# EAGLE design nRF52832_MCU (EAGLE 9.6.2)
Contributed by Nordic Semiconductor Product Page here <http://infocenter.nordicsemi.com/index.jsp?topic=%2Fcom.nordic.infocenter.nrf52832.ps.v1.1%2Fref_circuitry.html> Disclaimer: For the most up to date reference layout see the infocenter at nordicsemi.com Description: Bluetooth Low Energy board

## Sheet 1 of 2
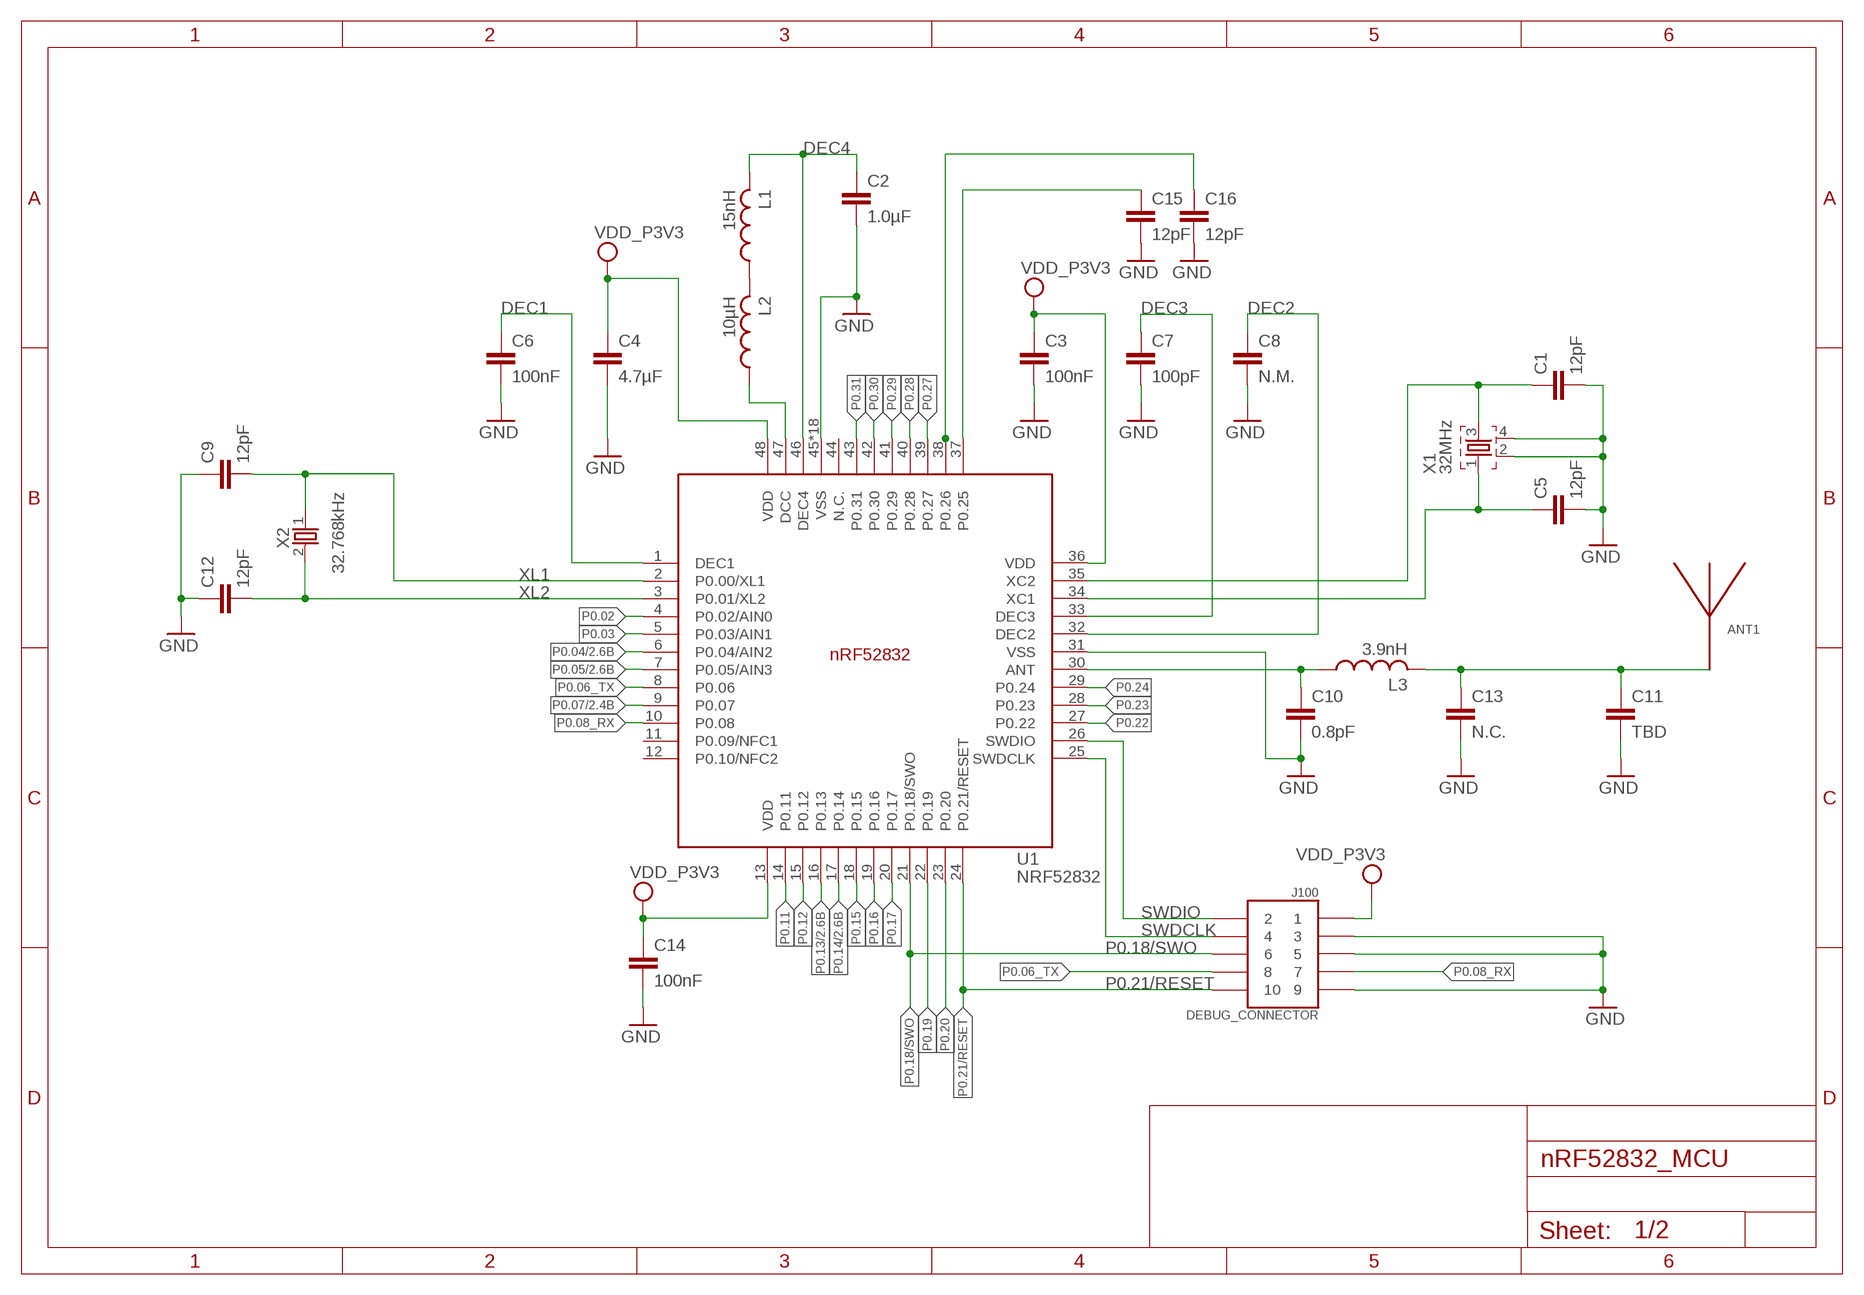
[diagram p0: schematic, sheet 1]

### Parts
ANT1  ANTENNA_QUARTER-WAVE_MONOPOLE_MEANDERED_LEFT  [QWMP_MEANDERED_LEFT_+6]
C1  12pF  CAPACITOR_0402_N  [RESC0402_N]
C2  1.0µF  CAPACITOR_0603_N  [RESC0603_N]
C3  100nF  CAPACITOR_0402_N  [RESC0402_N]
C4  4.7µF  CAPACITOR_0603_N  [RESC0603_N]
C5  12pF  CAPACITOR_0402_N  [RESC0402_N]
C6  100nF  CAPACITOR_0402_N  [RESC0402_N]
C7  100pF  CAPACITOR_0402_N  [RESC0402_N]
C8  N.M.  CAPACITOR_0402_N  [RESC0402_N]
C9  12pF  CAPACITOR_0402_N  [RESC0402_N]
C10  0.8pF  CAPACITOR_0402_N  [RESC0402_N]
C11  TBD  CAPACITOR_0402_N  [RESC0402_N]
C12  12pF  CAPACITOR_0402_N  [RESC0402_N]
C13  N.C.  CAPACITOR_0402_N  [RESC0402_N]
C14  100nF  CAPACITOR_0402_N  [RESC0402_N]
C15  12pF  CAPACITOR_0402_N  [RESC0402_N]
C16  12pF  CAPACITOR_0402_N  [RESC0402_N]
J100  DEBUG_CONNECTOR  [HDRV127P5X2-10_N]
L1  15nH  INDUCTOR_0402_N  [RESC0402_N]
L2  10µH  INDUCTOR_0603_N  [RESC0603_N]
L3  3.9nH  INDUCTOR_0402_N  [RESC0402_N]
U1  NRF52832  [QFN40P600X600X90-48_N]
X1  32MHz  XTAL_32MHZ  [BT-XTAL_2016_N]
X2  32.768kHz  XTAL_32KHZ  [XTAL_3215_N]

### Nets
ANT: C10.1 L3.1 U1.30(ANT)
DEC1: C6.1 U1.1(DEC1)
DEC2: C8.1 U1.32(DEC2)
DEC3: C7.1 U1.33(DEC3)
DEC4: C2.1 L1.2 U1.46(DEC4)
N$2: L1.1 L2.2
N$3: C1.1 U1.35(XC2) X1.3
N$4: L2.1 U1.47(DCC)
N$5: ANT1.P$1 C11.1 C13.1 L3.2
N$10: C1.2 C2.2 C3.2 C4.2 C5.2 C6.2 C7.2 C8.2 C9.1 C10.2 C11.2 C12.1 C13.2 C14.2 C15.2 C16.2 J100.3 J100.5 J100.9 U1.31(VSS) U1.45(VSS) U1.PAD(VSS) U1.PAD@VIA01(VSS) U1.PAD@VIA02(VSS) U1.PAD@VIA03(VSS) U1.PAD@VIA04(VSS) U1.PAD@VIA05(VSS) U1.PAD@VIA06(VSS) U1.PAD@VIA07(VSS) U1.PAD@VIA08(VSS) U1.PAD@VIA09(VSS) U1.PAD@VIA10(VSS) U1.PAD@VIA11(VSS) U1.PAD@VIA12(VSS) U1.PAD@VIA13(VSS) U1.PAD@VIA14(VSS) U1.PAD@VIA15(VSS) U1.PAD@VIA16(VSS) X1.2 X1.4 ; supply symbol labelled GND ; also sheet 2
P0.02: U1.4(P0.02/AIN0)
P0.03: U1.5(P0.03/AIN1)
P0.04: U1.6(P0.04/AIN2) ; also sheet 2
P0.05: U1.7(P0.05/AIN3) ; also sheet 2
P0.06_TX: J100.8 U1.8(P0.06)
P0.07: U1.9(P0.07) ; also sheet 2
P0.08_RX: J100.7 U1.10(P0.08)
P0.11: U1.14(P0.11)
P0.12: U1.15(P0.12)
P0.13: U1.16(P0.13) ; also sheet 2
P0.14: U1.17(P0.14) ; also sheet 2
P0.15: U1.18(P0.15)
P0.16: U1.19(P0.16)
P0.17: U1.20(P0.17)
P0.18/SWO: J100.6 U1.21(P0.18/SWO)
P0.19: U1.22(P0.19)
P0.20: U1.23(P0.20)
P0.21/RESET: J100.10 U1.24(P0.21/RESET)
P0.22: U1.27(P0.22)
P0.23: U1.28(P0.23)
P0.24: U1.29(P0.24)
P0.25: C15.1 U1.37(P0.25)
P0.26: C16.1 U1.38(P0.26)
P0.27: U1.39(P0.27)
P0.28: U1.40(P0.28)
P0.29: U1.41(P0.29)
P0.30: U1.42(P0.30)
P0.31: U1.43(P0.31)
SWDCLK: J100.4 U1.25(SWDCLK)
SWDIO: J100.2 U1.26(SWDIO)
VDD_P3V3: C3.1 C4.1 C14.1 J100.1 U1.13(VDD) U1.36(VDD) U1.48(VDD) ; also sheet 2
X1: C5.1 U1.34(XC1) X1.1
XL1: C9.2 U1.2(P0.00/XL1) X2.1
XL2: C12.2 U1.3(P0.01/XL2) X2.2
Unconnected: U1.11(P0.09/NFC1) U1.12(P0.10/NFC2) U1.44(N.C.)

## Sheet 2 of 2
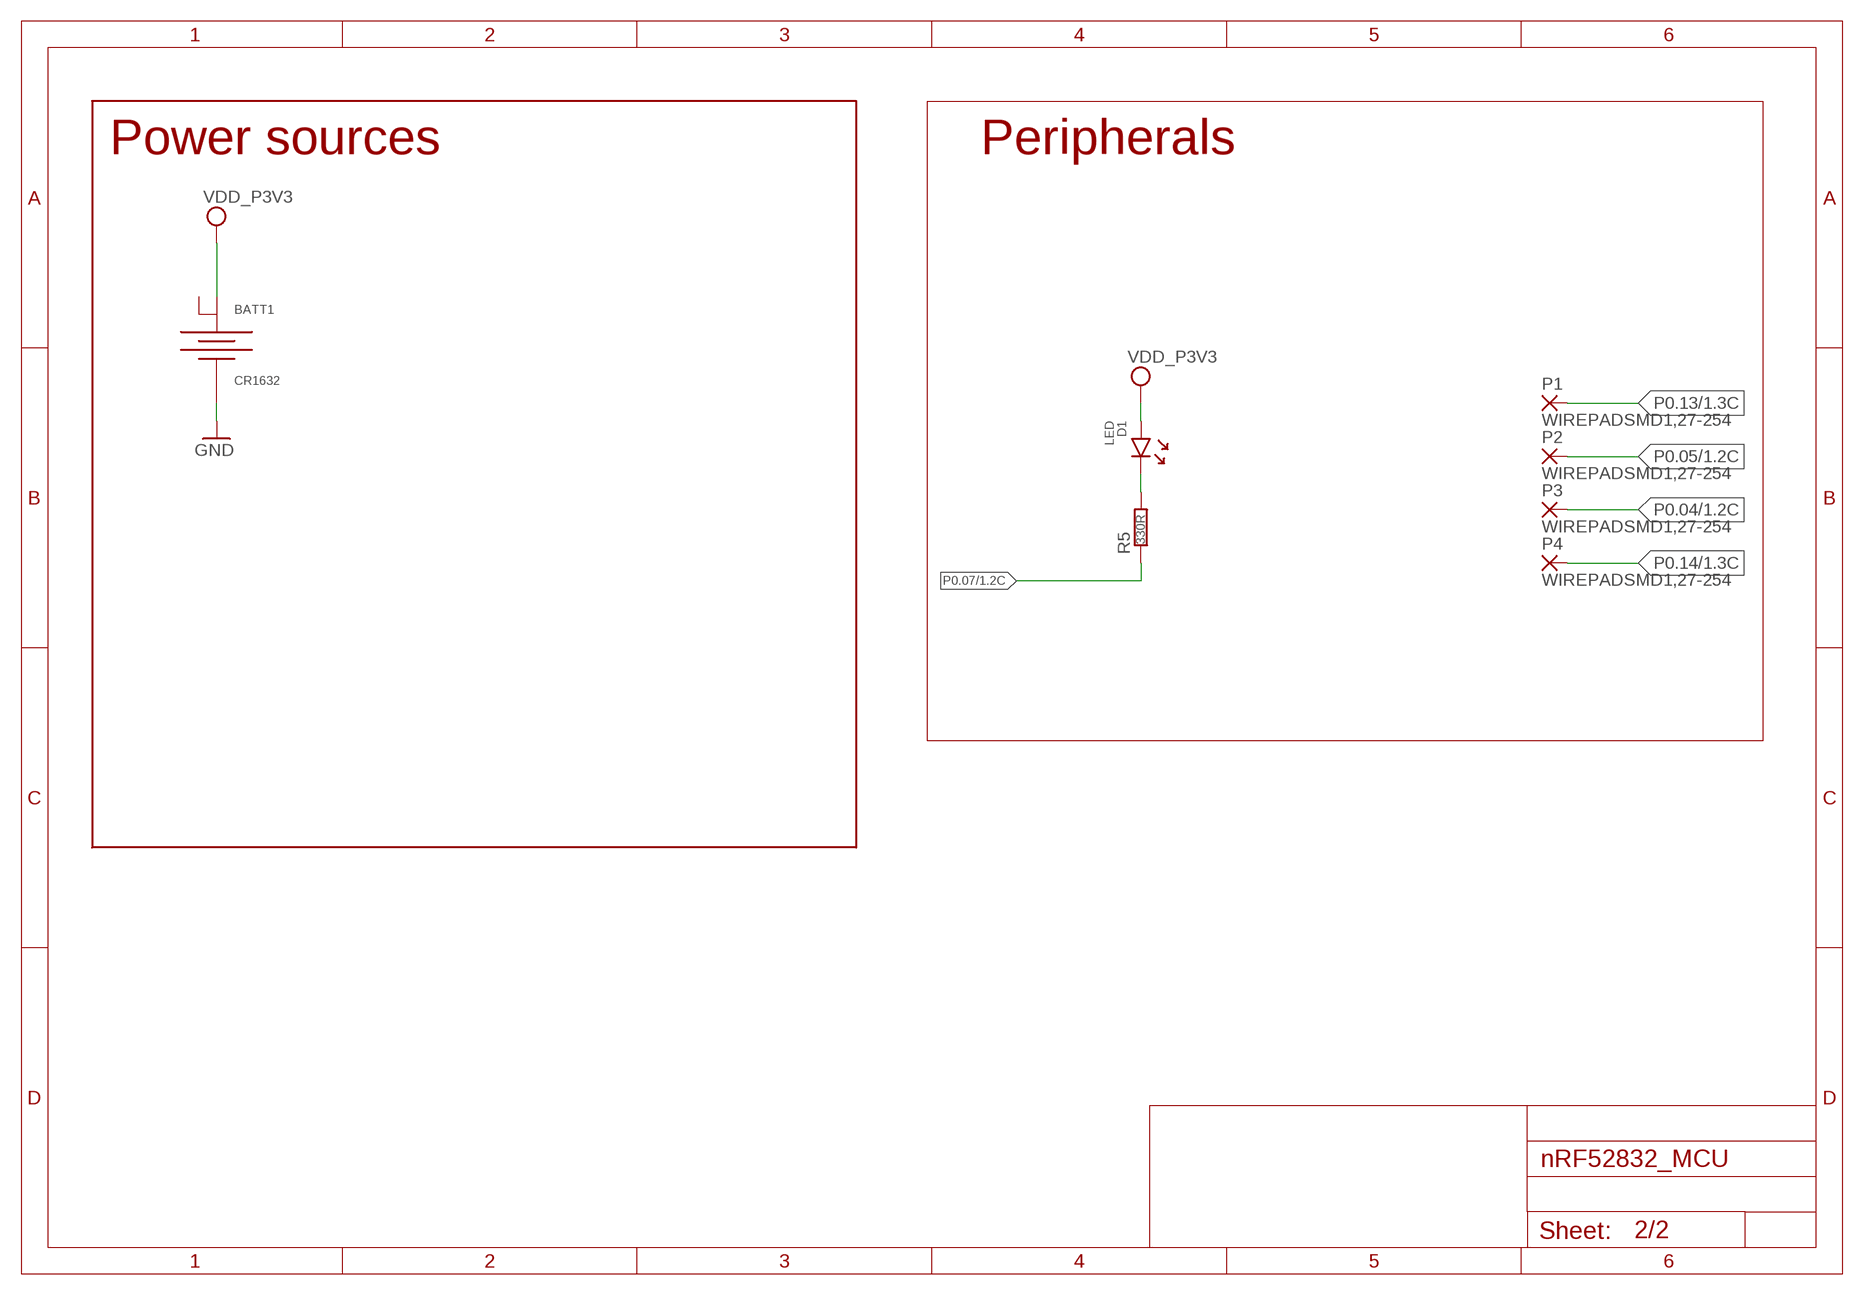
[diagram p1: schematic, sheet 2]

### Parts
BATT1  CR1632  [CR1632_HOLDER_TH]
D1  LED  [DIOC0603_N]
P1  WIREPADSMD1,27-254  [SMD1,27-2,54]
P2  WIREPADSMD1,27-254  [SMD1,27-2,54]
P3  WIREPADSMD1,27-254  [SMD1,27-2,54]
P4  WIREPADSMD1,27-254  [SMD1,27-2,54]
R5  330R  RESISTOR_0402_N  [RESC0402_N]

### Nets
N$8: D1.1(C) R5.2
N$10: BATT1.1(-) ; supply symbol labelled GND ; also sheet 1
P0.04: P3.1(P) ; also sheet 1
P0.05: P2.1(P) ; also sheet 1
P0.07: R5.1 ; also sheet 1
P0.13: P1.1(P) ; also sheet 1
P0.14: P4.1(P) ; also sheet 1
VDD_P3V3: BATT1.2(+) D1.2(A) ; also sheet 1
Unconnected: BATT1.3(+2)

### Notes on the sheet
- Power sources | Peripherals

## Library data of the parts
ANT1 = Nordic_misc:ANTENNA_QUARTER-WAVE_MONOPOLE_MEANDERED_LEFT
BATT1 = Nordic_misc:CR1632: KEYSTONE 3013 BATTERY THM RETAINER, 16MM Farnell: 1650698
C1-C16 = Nordic_misc:CAPACITOR: Generic chip capacitor
D1 = Nordic_misc:LED
J100 = Nordic_misc:DEBUG_CONNECTOR
L1-L3 = Nordic_misc:INDUCTOR: Generic chip inductor
P1-P4 = wirepad:WIREPAD: Wire PAD connect wire on PCB
R5 = Nordic_misc:RESISTOR: Generic chip resistor
U1 = Nordic_nRF:NRF52832: nRF52832 Features Single chip, highly flexible, 2.4 GHz multi-protocol SoC 32-bit ARM Cortex-M4F Processor 1.7v to 3.6v operation 512kB flash + 64kB RAM Supports concurrent Bluetooth Smart/ANT protocol operation On-chip NFC tag for Out-of-Band (OOB) pairing Up to +4dBm output power -96dBm sensitivity, Bluetooth Smart Thread safe and run-time protected Event driven API On air compatible with nRF24L and nRF24AP series 2 data rates (2Mbps/1Mbps) PPI - maximum flexibility for power-efficient applications and code simplification Automated power management system with automatic power management of each peripheral Configurable I/O mapping for analog and digital I/O 3 x Master/Slave SPI 2 x Two-wire interface (I²C) UART (RTS/CTS) 3 x PWM AES HW encryption Real Time Counter (RTC) Digital microphone interface (PDM) On-chip balun Applications Internet of Things (IoT) Wearables SmartHome sensors Connected white goods Computer peripherals Voice-command smart remotes A4WP ‘Rezence’ wireless charging Beacons Sports and fitness sensors and hubs Connected health products Smart watches RC Toys Interactive games Building automation and sensor networks
X1 = Nordic_nRF:XTAL_32MHZ
X2 = Nordic_nRF:XTAL_32KHZ

## Net classes
0 default: clearance 0.205 mm

## Board
Contributed by Nordic Semiconductor Product Page here <http://infocenter.nordicsemi.com/index.jsp?topic=%2Fcom.nordic.infocenter.nrf52832.ps.v1.1%2Fref_circuitry.html> Disclaimer: For the most up to date reference layout see the infocenter at nordicsemi.com Description: Bluetooth Low Energy board
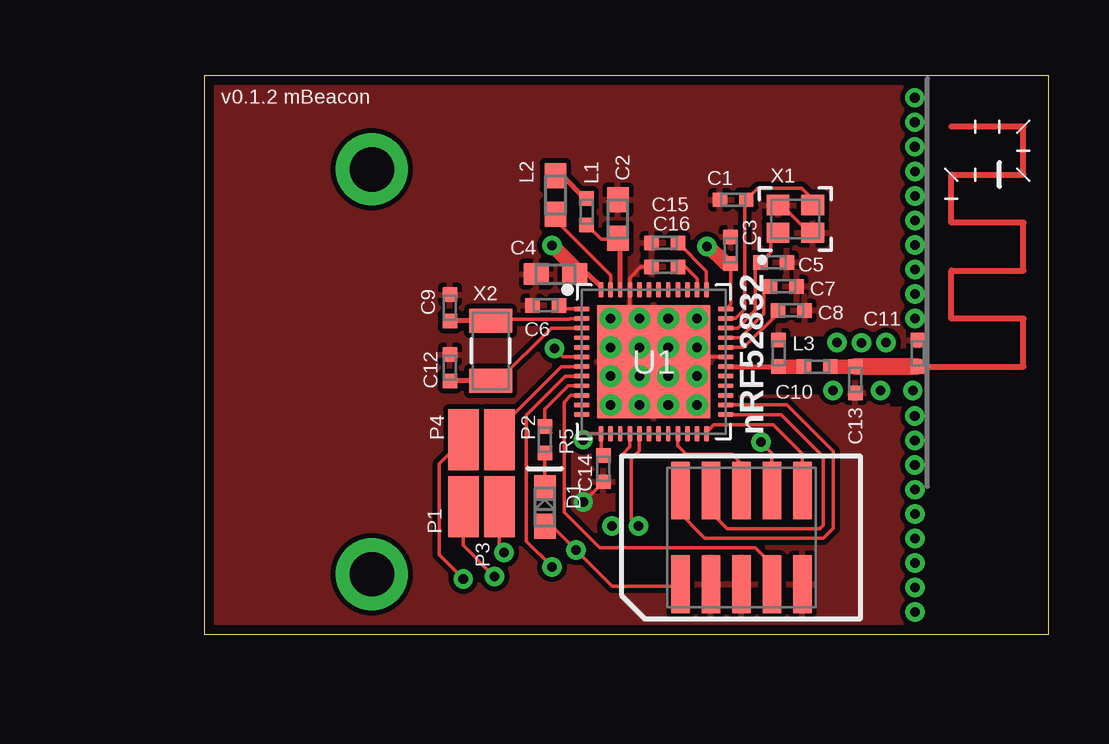
[diagram p2: board, top side]
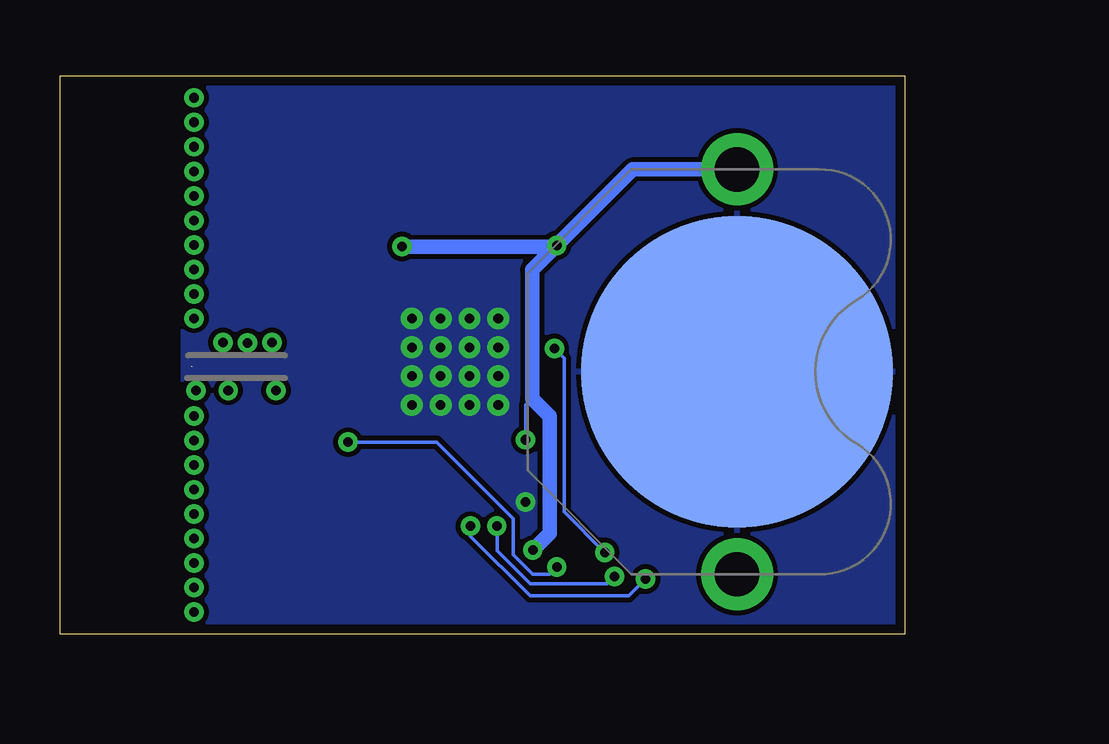
[diagram p3: board, bottom side, seen from below]

Size 35.2 x 23.26 mm. Coordinates in mm from the lower left corner, seen from the top.
Outline: 0,0 35.2,0 35.2,23.26 0,23.26 0,0
Copper layers (1*16): Top 0.035mm / dielectric 1.5mm / Bottom 0.035mm
Design rules "nRF52832_MCU *": minimum track width 0.15mm, minimum drill 0.4mm, track to track 0.15mm, track to pad 0.15mm, pad to pad 0.15mm, via to via 0.15mm, smd to smd 0.15mm, copper to edge 0.4mm, drill to drill 0.4mm, minimum pad ring 10mil, minimum via ring 8mil, stop-mask expansion 0.1mm, vias tented up to drill 0.41mm, thermal gap 0.2mm
tRestrict: area 28.6,9.5 to 30.1,11.9; area 30.2,0 to 35.2,23.1; area 22,10 to 25.7,12.4
bRestrict: area 30.2,0 to 35.2,23.1

### Footprints (pad centres in the part's own frame; a part is rotated, then mirrored left to right if it is on the bottom)
QWMP_MEANDERED_LEFT_+6 = smd 0.254 x 0.254: P$1 0,0
CR1632_HOLDER_TH = smd 13 x 13: 1 0,0 | drill 1.85 pad 3: 2 -8.435,0; 3 8.435,0
RESC0402_N = smd 0.6 x 0.6: 1 -0.55,0; 2 0.55,0
RESC0603_N = smd 1.05 x 0.9: 1 -0.8,0; 2 0.8,0
DIOC0603_N = smd 1.05 x 0.9: 1 -0.8,0; 2 0.8,0
HDRV127P5X2-10_N = smd 0.76 x 2.4: 1 -2.54,-1.95; 2 -2.54,1.95; 3 -1.27,-1.95; 4 -1.27,1.95; 5 0,-1.95; 6 0,1.95; 7 1.27,-1.95; 8 1.27,1.95; 9 2.54,-1.95; 10 2.54,1.95
SMD1,27-2,54 = smd 1.27 x 2.54: 1 0,0
QFN40P600X600X90-48_N = smd 0.65 x 0.2: 1 -3,2.2; 2 -3,1.8; 3 -3,1.4; 4 -3,1; 5 -3,0.6; 6 -3,0.2; 7 -3,-0.2; 8 -3,-0.6; 9 -3,-1; 10 -3,-1.4; 11 -3,-1.8; 12 -3,-2.2; 25 3,-2.2; 26 3,-1.8; 27 3,-1.4; 28 3,-1; 29 3,-0.6; 30 3,-0.2; 31 3,0.2; 32 3,0.6; 33 3,1; 34 3,1.4; 35 3,1.8; 36 3,2.2 | smd 0.2 x 0.65: 13 -2.2,-3; 14 -1.8,-3; 15 -1.4,-3; 16 -1,-3; 17 -0.6,-3; 18 -0.2,-3; 19 0.2,-3; 20 0.6,-3; 21 1,-3; 22 1.4,-3; 23 1.8,-3; 24 2.2,-3; 37 2.2,3; 38 1.8,3; 39 1.4,3; 40 1,3; 41 0.6,3; 42 0.2,3; 43 -0.2,3; 44 -0.6,3; 45 -1,3; 46 -1.4,3; 47 -1.8,3; 48 -2.2,3 | smd 4.7 x 4.7: PAD 0,0 | drill 0.4: PAD@VIA01 -1.8,1.8; PAD@VIA02 -1.8,0.6; PAD@VIA03 -1.8,-0.6; PAD@VIA04 -1.8,-1.8; PAD@VIA05 -0.6,1.8; PAD@VIA06 -0.6,0.6; PAD@VIA07 -0.6,-0.6; PAD@VIA08 -0.6,-1.8; PAD@VIA09 0.6,1.8; PAD@VIA10 0.6,0.6; PAD@VIA11 0.6,-0.6; PAD@VIA12 0.6,-1.8; PAD@VIA13 1.8,1.8; PAD@VIA14 1.8,0.6; PAD@VIA15 1.8,-0.6; PAD@VIA16 1.8,-1.8
BT-XTAL_2016_N = smd 0.95 x 0.85: 1 -0.725,-0.575; 2 0.725,-0.575; 3 0.725,0.575; 4 -0.725,0.575
XTAL_3215_N = smd 1 x 1.8: 1 -1.25,0; 2 1.25,0

### Placement (x,y rotation side)
ANT1  30.14,11.15 0 top
BATT1  6.99,10.93 270 bottom
C1  22.04,18.1 180 top
C2  17.24,17.3 90 top
C3  21.94,16 90 top
C4  14.64,15 180 top
C5  23.73,15.49 0 top
C6  14.24,13.7 180 top
C7  24.14,14.49 0 top
C8  24.47,13.49 0 top
C9  10.24,13.6 270 top
C10  23.94,11.7 90 top
C11  29.74,11.7 90 top
C12  10.24,11.1 270 top
C13  27.14,10.6 270 top
C14  16.64,6.9 270 top
C15  19.2,16.3 180 top
C16  19.2,15.3 180 top
D1  14.2,5.3 270 top
J100  22.39,4.03 0 top
L1  15.94,17.6 270 top
L2  14.64,18.3 90 top
L3  25.54,11.15 0 top
P1  10.8,5.3 0 top
P2  12.3,8.1 0 top
P3  12.3,5.3 0 top
P4  10.8,8.1 0 top
R5  14.2,8.1 270 top
U1  18.74,11.35 0 top
X1  24.64,17.3 0 top
X2  11.94,11.8 270 top

### Tracks (layer width: path | path; a pad name or v marks a point on that pad's centre or on a via)
ANT
  Top 0.152: C10.1 23.99,11.15
  Top 0.2: U1.30 C10.1
  Top 0.6: 23.99,11.15 L3.1
DEC1
  Top 0.152: U1.1 14.95,13.55 14.86,13.58 14.74,13.7 C6.1
DEC2
  Top 0.152: C8.1 23.92,13.38 22.49,11.95 U1.32
DEC3
  Top 0.152: C7.1 23.32,14.22 23.32,13.34 22.34,12.35 U1.33
DEC4
  Top 0.152: L1.2 16.54,16.45 17.34,16.45
  Top 0.2: U1.46 17.34,16.45 C2.1
N$1  (via drill 0.4)
  other vias: 29.62,13.16
N$2
  Top 0.2: L1.1 15.89,18.15 14.94,19.1 L2.2
N$3
  Top 0.152: X1.3 25.36,18.12 24.91,18.58 23.07,18.58 C1.1 22.52,18.04 22.52,13.54 22.15,13.17 21.76,13.17 U1.35
N$4
  Top 0.152: U1.47 16.94,14.96 14.64,17.26 L2.1
N$5  (1 unrouted)
  Top 0.254: ANT1.P$1 C11.1
  Top 0.6: L3.2 C13.1
  Top 0.7: 29.69,11.15 C13.1
N$6  (via drill 0.4)
  other vias: 29.62,14.18
N$7  (via drill 0.4)
  other vias: 28.19,10.16
N$8
  Top 0.152: R5.2 D1.1
N$9  (via drill 0.4)
  other vias: 26.2,10.16
N$10  (via drill 0.4)
  Top 0.152: U1.31 20.94,11.55 U1.PAD@VIA14 | U1.PAD@VIA05 17.74,13.55 U1.45 17.74,14.84 18.2,15.3 C16.2 | C14.2 v15.8,5.5 | X1.2 25.12,16.97 24.97,16.97 24.07,17.88 X1.4
  Top 0.2: U1.PAD 19.34,11.7 U1.PAD@VIA11
  pour Bottom: 0,0 0,23.26 35.2,23.26 35.2,0
  pour Top: 0,0 0,23.26 35.2,23.26 35.2,0
N$11  (via drill 0.4)
  other vias: 29.62,15.2
N$12  (via drill 0.4)
  other vias: 29.62,16.22
N$13  (via drill 0.4)
  other vias: 29.62,17.24
N$14  (via drill 0.4)
  other vias: 29.62,18.26
N$15  (via drill 0.4)
  other vias: 29.62,19.28
N$16  (via drill 0.4)
  other vias: 29.61,20.31
N$17  (via drill 0.4)
  other vias: 29.61,21.33
N$18  (via drill 0.4)
  other vias: 29.61,22.35
N$20  (via drill 0.4)
  other vias: 29.62,0.92
N$22  (via drill 0.4)
  other vias: 29.62,1.94
N$23  (via drill 0.4)
  other vias: 29.62,2.96
N$24  (via drill 0.4)
  other vias: 29.62,3.98
N$25  (via drill 0.4)
  other vias: 29.62,5
N$26  (via drill 0.4)
  other vias: 29.62,6.02
N$27  (via drill 0.4)
  other vias: 29.61,7.05
N$28  (via drill 0.4)
  other vias: 29.61,8.07
N$29  (via drill 0.4)
  other vias: 29.61,9.09
N$31  (via drill 0.4)
  other vias: 26.37,12.15
N$32  (via drill 0.4)
  other vias: 27.39,12.14
N$33  (via drill 0.4)
  other vias: 29.53,10.16
N$35  (via drill 0.4)
  other vias: 28.41,12.15
P0.04  (via drill 0.4)
  Top 0.152: v14.6,11.9 14.95,11.55 U1.6 | v12.5,3.4 12.3,3.6 P3.1
  Bottom 0.152: v14.6,11.9 14.2,11.5 14.2,5.1 v12.5,3.4
P0.05
  Top 0.152: P2.1 12.3,8.57 14.88,11.15 U1.7
P0.06_TX  (via drill 0.4)
  Top 0.152: v23.2,8 23.66,7.54 J100.8 | U1.8 15.05,10.75 13.42,9.12 13.42,3.88 v14.5,2.8
  Bottom 0.152: v14.5,2.8 14.8,2.5 15.5,2.5 16.32,3.32 16.32,4.82 19.5,8 v23.2,8
P0.07
  Top 0.152: R5.1 14.2,9.37 15.18,10.35 U1.9
P0.08_RX
  Top 0.152: J100.7 23.66,2.91 22.96,3.61 16.48,3.61 15,5.09 15,9.66 15.29,9.95 U1.10
P0.13  (via drill 0.4)
  Top 0.152: U1.16 17.74,7.8 17.42,7.48 17.42,4.92 v17,4.5 | v12.1,2.4 10.8,3.7 P1.1
  Bottom 0.152: v17,4.5 16.97,4.47 16.97,3.47 15.61,2.1 12.4,2.1 v12.1,2.4
P0.14  (via drill 0.4)
  Top 0.152: P4.1 9.8,7.1 9.8,3.3 v10.8,2.3 | v18.1,4.5 17.8,4.8 17.8,7.3 18.14,7.64 U1.17
  Bottom 0.152: v18.1,4.5 18.1,4.09 15.61,1.6 11.5,1.6 v10.8,2.3
P0.18/SWO
  Top 0.152: U1.21 19.74,7.86 20.1,7.5 22,7.5 22.39,7.11 J100.6
P0.21/RESET
  Top 0.152: U1.24 20.94,8.42 21.24,8.72 23.72,8.72 24.93,7.51 J100.10
P0.25
  Top 0.152: C15.1 20.92,15.13 20.92,14.72 U1.37
P0.26
  Top 0.152: C16.1 20.05,15.3 20.54,14.8 U1.38
SWDCLK
  Top 0.152: U1.25 24.05,9.15 25.8,7.4 25.8,4.55 25.65,4.4 21.8,4.4 21.2,5 21.2,5.9 J100.4
SWDIO
  Top 0.152: U1.26 24.27,9.55 26.21,7.61 26.21,4.41 25.8,4 20.87,4 19.67,5.2 19.67,5.8 J100.2
VDD_P3V3  (via drill 0.4, 0.4 pad 0.8)
  Top 0.152: D1.2 14.5,4.5 v15.5,3.5 17,2 19.85,2 J100.1 | C3.1 21.94,13.75 U1.36 | C14.1 16.54,7.55 U1.13 16.05,8.35 v15.8,8.1
  Top 0.2: C4.1 15.99,15 16.54,14.45 U1.48
  Top 0.6: C4.1 15.44,15.26 v14.5,16.2 | C3.1 21.73,15.45 21.03,16.15 v20.95,16.15
  Bottom 0.152: 15.53,9.8 15.53,9.82 15.8,9.55 v15.8,8.1
  Bottom 0.6: BATT1.2 11.34,19.36 v14.5,16.2 | 15.53,9.82 15.53,15.18 v14.5,16.2 | v15.5,3.5 14.8,4.2 14.8,9.07 15.53,9.8 | v20.95,16.15 14.55,16.15 v14.5,16.2
X1
  Top 0.152: X1.1 23.61,16.41 23.61,15.91 C5.1 22.97,15.28 22.97,13.49 22.23,12.75 U1.34
XL1
  Top 0.152: U1.2 15.24,13.15 15.21,13.12 12.01,13.12 X2.1
  Top 0.2: X2.1 C9.2
XL2
  Top 0.152: U1.3 14.46,12.75 12.26,10.55 X2.2
  Top 0.2: X2.2 C12.2

### Text on the board
tPlace: nRF52832
tNames: v0.1.2 mBeacon